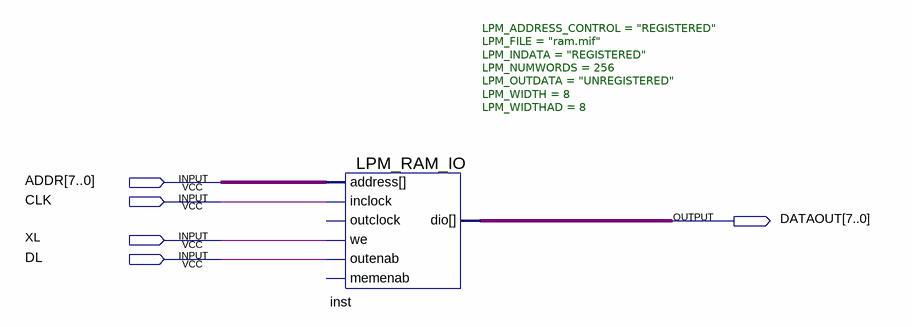
[diagram p0: schematic sheet]
// Quartus schematic ram.bdf as structural Verilog: 1 symbols, 5 pins
module ram (
  input  [7:0] ADDR,
  input  CLK,
  input  XL,
  input  DL,
  output [7:0] DATAOUT
);

  LPM_RAM_IO #(.LPM_ADDRESS_CONTROL("REGISTERED"), .LPM_FILE("ram.mif"), .LPM_INDATA("REGISTERED"), .LPM_NUMWORDS(256), .LPM_OUTDATA("UNREGISTERED"), .LPM_WIDTH(8), .LPM_WIDTHAD(8)) inst (
    .address(ADDR), .inclock(CLK), .we(XL), .outenab(DL), .dio(DATAOUT));  // open: outclock, memenab
endmodule
